# EAGLE design M165D (EAGLE 6.6.0)
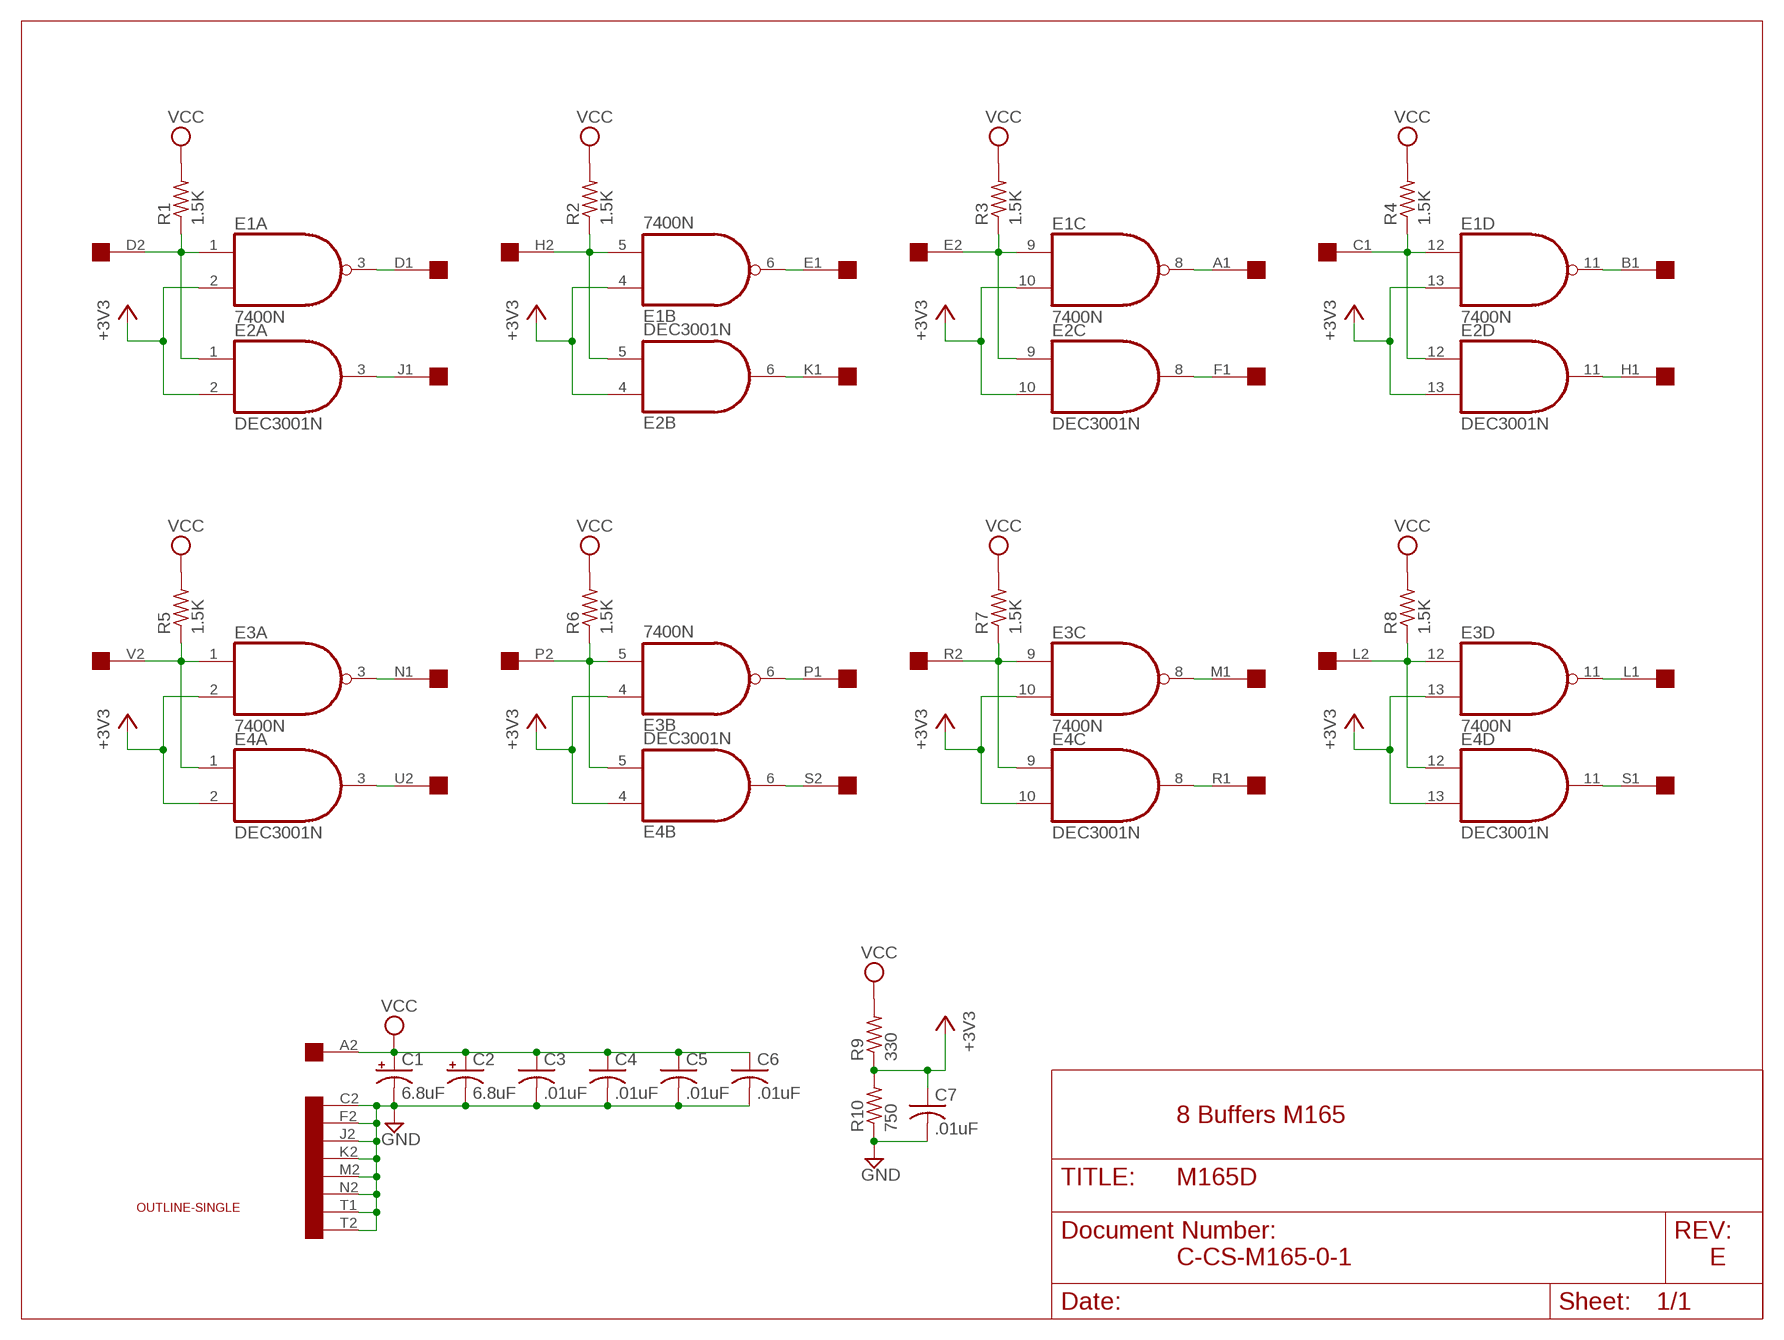
[diagram p0: schematic, sheet 1]

## Parts
C1  6.8uF  CPOL-USE25-9AXIAL  [E25-9]
C2  6.8uF  CPOL-USE25-9AXIAL  [E25-9]
C3  .01uF  C-US050-025X075  [C050-025X075]
C4  .01uF  C-US050-025X075  [C050-025X075]
C5  .01uF  C-US050-025X075  [C050-025X075]
C6  .01uF  C-US050-025X075  [C050-025X075]
C7  .01uF  C-US050-025X075  [C050-025X075]
E1  7400N  [DIL14]
E2  DEC3001N  74S08N  [DIL14]
E3  7400N  [DIL14]
E4  DEC3001N  74S08N  [DIL14]
R1  1.5K  R-US_0207/10  [0207/10]
R2  1.5K  R-US_0207/10  [0207/10]
R3  1.5K  R-US_0207/10  [0207/10]
R4  1.5K  R-US_0207/10  [0207/10]
R5  1.5K  R-US_0207/10  [0207/10]
R6  1.5K  R-US_0207/10  [0207/10]
R7  1.5K  R-US_0207/10  [0207/10]
R8  1.5K  R-US_0207/10  [0207/10]
R9  330  R-US_0207/10  [0207/10]
R10  750  R-US_0207/10  [0207/10]
U$1  SINGLE  [EDGE-CON2]
U$2  OUTLINE-SINGLE  [SINGLE]

## Nets
+3V3 [supply]: C7.1 E1.2(A:I1) E1.4(B:I0) E1.10(C:I1) E1.13(D:I1) E2.2(A:I1) E2.4(B:I0) E2.10(C:I1) E2.13(D:I1) E3.2(A:I1) E3.4(B:I0) E3.10(C:I1) E3.13(D:I1) E4.2(A:I1) E4.4(B:I0) E4.10(C:I1) E4.13(D:I1) R9.1 R10.2
GND [supply]: C1.- C2.- C3.2 C4.2 C5.2 C6.2 C7.2 R10.1 U$1.C2 U$1.F2 U$1.J2 U$1.K2 U$1.M2 U$1.N2 U$1.T1 U$1.T2
N$1: E1.1(A:I0) E2.1(A:I0) R1.1 U$1.D2
N$2: E1.5(B:I1) E2.5(B:I1) R2.1 U$1.H2
N$3: E2.3(A:O) U$1.J1
N$4: E1.3(A:O) U$1.D1
N$5: E2.6(B:O) U$1.K1
N$6: E1.6(B:O) U$1.E1
N$7: E1.9(C:I0) E2.9(C:I0) R3.1 U$1.E2
N$8: E2.8(C:O) U$1.F1
N$9: E1.8(C:O) U$1.A1
N$10: E1.12(D:I0) E2.12(D:I0) R4.1 U$1.C1
N$11: E2.11(D:O) U$1.H1
N$12: E1.11(D:O) U$1.B1
N$13: E3.1(A:I0) E4.1(A:I0) R5.1 U$1.V2
N$14: E4.3(A:O) U$1.U2
N$15: E3.3(A:O) U$1.N1
N$16: E3.5(B:I1) E4.5(B:I1) R6.1 U$1.P2
N$17: E4.6(B:O) U$1.S2
N$18: E3.6(B:O) U$1.P1
N$19: E3.9(C:I0) E4.9(C:I0) R7.1 U$1.R2
N$20: E4.8(C:O) U$1.R1
N$21: E3.8(C:O) U$1.M1
N$22: E3.12(D:I0) E4.12(D:I0) R8.1 U$1.L2
N$23: E4.11(D:O) U$1.S1
N$24: E3.11(D:O) U$1.L1
VCC [supply]: C1.+ C2.+ C3.1 C4.1 C5.1 C6.1 R1.2 R2.2 R3.2 R4.2 R5.2 R6.2 R7.2 R8.2 R9.2 U$1.A2
Unconnected: U$1.B2 U$1.U1 U$1.V1

## Notes on the sheet
- 8 Buffers M165
- C-CS-M165-0-1 | E

## Power pins joined to a net without a drawn wire
GND: E1.7(P:GND) E2.7(P:GND) E3.7(P:GND) E4.7(P:GND)
VCC: E1.14(P:VCC) E2.14(P:VCC) E3.14(P:VCC) E4.14(P:VCC)

## Library data of the parts
C1 C2 = rcl:CPOL-US: POLARIZED CAPACITOR, American symbol
C3-C7 = rcl:C-US: CAPACITOR, American symbol
E1 E3 = 74xx-us:74*00: Quad 2-input NAND gate
E2 E4 = 74xx-us:74*08: Quad 2-input AND gate
R1-R10 = rcl:R-US_: RESISTOR, American symbol
U$1 = dec-con:SINGLE: Single-Height DEC board
U$2 = dec-con:OUTLINE-*: Board outlines for DEC boards.

## Net classes
1 supply: width 0.813 mm

## Board
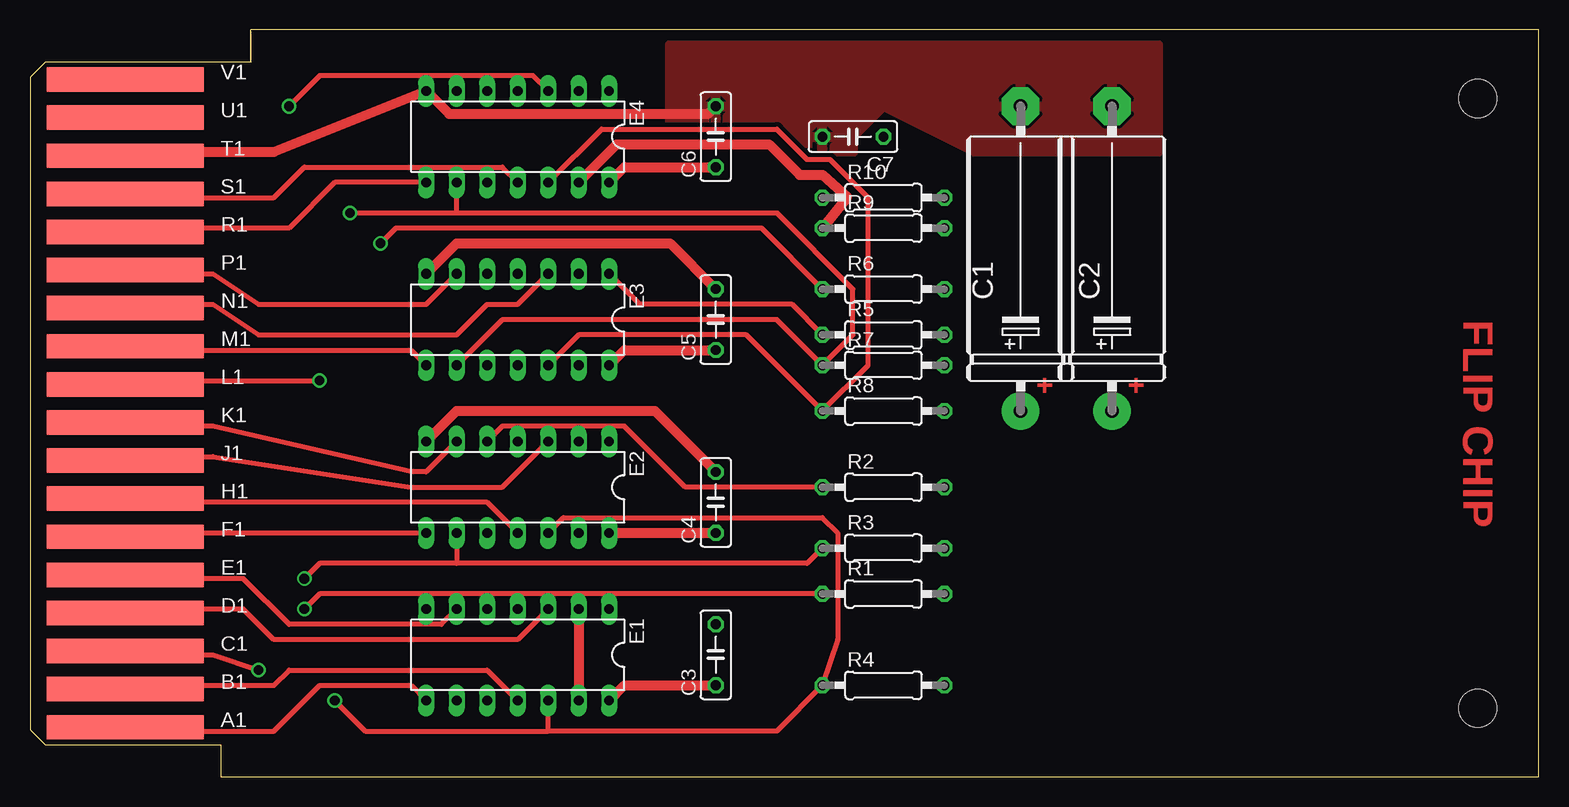
[diagram p1: board, top side]
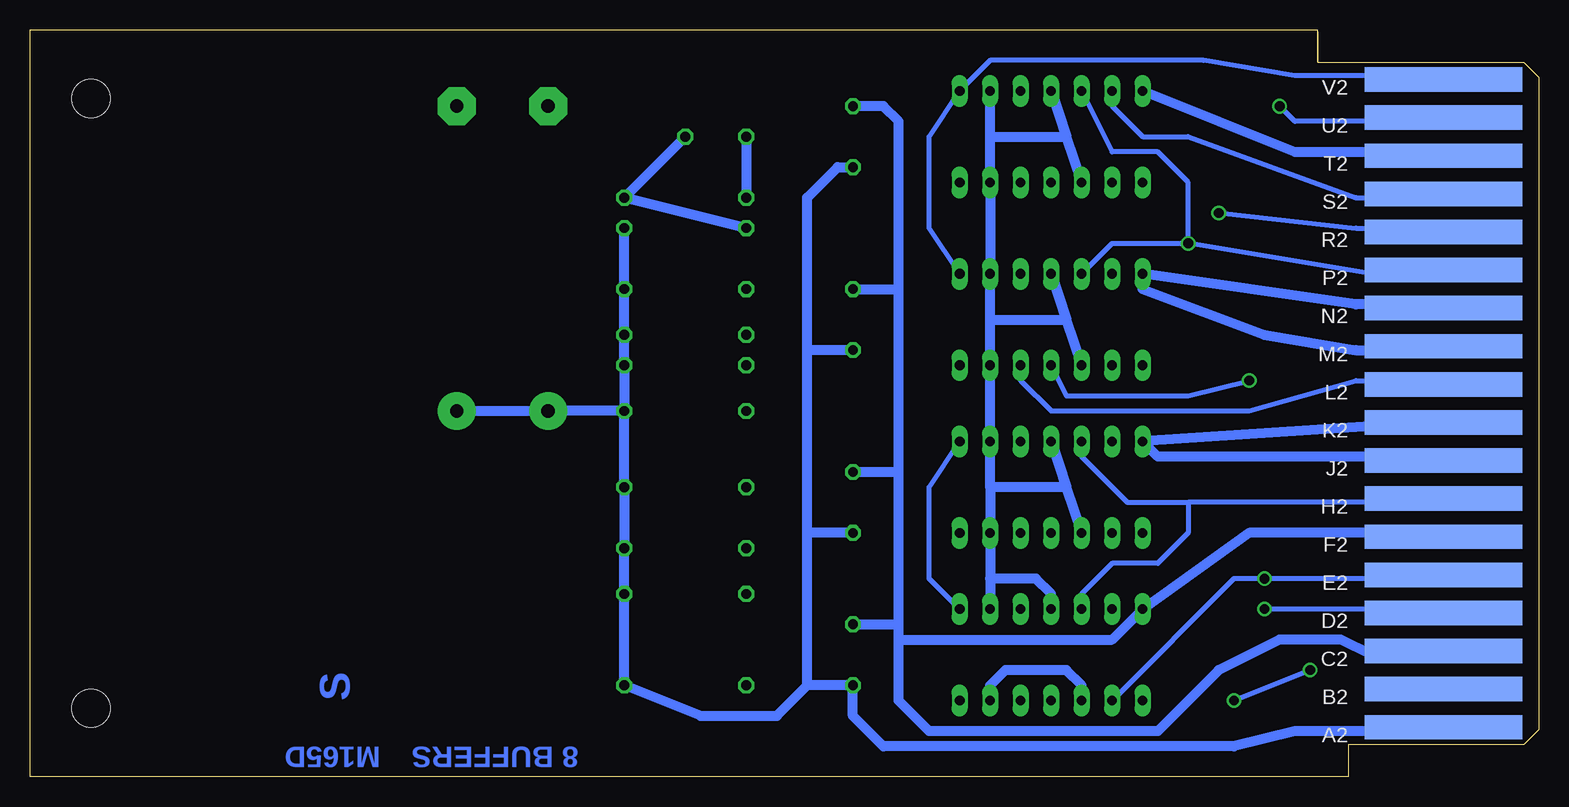
[diagram p2: board, bottom side, seen from below]

Size 125.73 x 62.23 mm. Coordinates in mm from the lower left corner, seen from the top.
Copper layers (1+16): Top 0.035mm / dielectric 1.5mm / Bottom 0.035mm
Design rules "16mils": minimum track width 16mil, minimum drill 32mil, track to track 15mil, track to pad 10mil, pad to pad 10mil, via to via 10mil, smd to smd 10mil, copper to edge 13mil, drill to drill 10mil, minimum pad ring 10mil, minimum via ring 8mil, stop-mask expansion 0mil, vias tented up to drill 0mil, thermal gap 10mil

### Footprints (pad centres in the part's own frame; a part is rotated, then mirrored left to right if it is on the bottom)
E25-9 = drill 1.118 pad 3.15: + -12.7,0 | drill 1.118 pad 3.15 octagon: - 12.7,0
C050-025X075 = drill 0.813 octagon: 1 -2.54,0; 2 2.54,0
DIL14 = drill 0.813 long: 1 -7.62,-3.81; 2 -5.08,-3.81; 3 -2.54,-3.81; 4 0,-3.81; 5 2.54,-3.81; 6 5.08,-3.81; 7 7.62,-3.81; 8 7.62,3.81; 9 5.08,3.81; 10 2.54,3.81; 11 0,3.81; 12 -2.54,3.81; 13 -5.08,3.81; 14 -7.62,3.81
0207/10 = drill 0.813 octagon: 1 -5.08,0; 2 5.08,0
EDGE-CON2 = smd 13.106 x 2.032: A1 7.938,4.128; B1 7.938,7.303; C1 7.938,10.477; D1 7.938,13.652; E1 7.938,16.828; F1 7.938,20.003; H1 7.938,23.177; J1 7.938,26.352; K1 7.938,29.527; L1 7.938,32.703; M1 7.938,35.877; N1 7.938,39.053; P1 7.938,42.227; R1 7.938,45.403; S1 7.938,48.578; T1 7.938,51.752; U1 7.938,54.928; V1 7.938,58.102 | smd 13.106 x 2.032 bottom: A2 7.938,4.128; B2 7.938,7.303; C2 7.938,10.477; D2 7.938,13.652; E2 7.938,16.828; F2 7.938,20.003; H2 7.938,23.177; J2 7.938,26.352; K2 7.938,29.527; L2 7.938,32.703; M2 7.938,35.877; N2 7.938,39.053; P2 7.938,42.227; R2 7.938,45.403; S2 7.938,48.578; T2 7.938,51.752; U2 7.938,54.928; V2 7.938,58.102
SINGLE = hole 3.175: 120.65,56.515; 120.65,5.715

### Placement (x,y rotation side)
C1  82.55,43.18 90 top
C2  90.17,43.18 90 top
C3  57.15,10.16 90 top
C4  57.15,22.86 90 top
C5  57.15,38.1 90 top
C6  57.15,53.34 90 top
C7  68.58,53.34 180 top
E1  40.64,10.16 180 top
E2  40.64,24.13 180 top
E3  40.64,38.1 180 top
E4  40.64,53.34 180 top
R1  71.12,15.24 0 top
R2  71.12,24.13 0 top
R3  71.12,19.05 0 top
R4  71.12,7.62 0 top
R5  71.12,36.83 0 top
R6  71.12,40.64 0 top
R7  71.12,34.29 0 top
R8  71.12,30.48 0 top
R9  71.12,45.72 0 top
R10  71.12,48.26 0 top
U$1  0,0 0 top
U$2  0,0 0 top

### Tracks (layer width: path | path; a pad name or v marks a point on that pad's centre or on a via)
+3V3
  Top 0.813: E1.2 E1.13 | E4.13 48.9,52.7 61.6,52.7 64.14,50.16 66.04,50.16 68.09,48.3 R9.1
  Bottom 0.813: E1.10 38.1,7.62 39.37,8.89 44.45,8.89 45.72,7.62 E1.13 | E1.4 40.64,15.24 41.91,16.51 45.72,16.51 | 45.72,16.51 E1.2 | 45.72,16.51 E2.13 45.72,24.13 | E2.10 39.37,24.13 | 39.37,24.13 45.72,24.13 | E2.4 39.37,24.13 | 45.72,24.13 E2.2 E3.13 45.72,38.1 | 45.72,38.1 39.37,38.1 | 39.37,38.1 E3.10 | E3.4 39.37,38.1 | 45.72,38.1 E3.2 E4.13 45.72,53.34 | 45.72,53.34 39.37,53.34 | 39.37,53.34 E4.10 | E4.4 39.37,53.34 | 45.72,53.34 E4.2 | R9.1 R10.2 C7.1
GND
  Top 0.813: E2.7 35.56,30.48 52.07,30.48 C4.2 | E3.7 35.56,44.45 53.34,44.45 C5.2 | U$1.T1 8.89,52.07 20.32,52.07 E4.7 34.93,55.24 56.52,55.24 C6.2
  Bottom 0.813: U$1.C2 8.89,10.16 13.97,10.16 16.51,11.43 21.59,11.43 26.67,8.89 31.75,3.81 50.8,3.81 53.34,6.35 53.34,11.43 | 53.34,11.43 35.56,11.43 E1.7 24.13,20.32 8.89,20.32 U$1.F2 | 53.34,11.43 53.34,12.7 | 53.34,12.7 53.34,25.4 | 53.34,25.4 53.34,40.64 | 53.34,40.64 53.34,54.61 54.61,55.88 C6.2 | C5.2 53.34,40.64 | C4.2 53.34,25.4 | C3.2 53.34,12.7 | U$1.J2 8.89,26.67 31.75,26.67 E2.7 13.97,29.21 8.26,29.21 U$1.K2 | U$1.M2 8.89,35.56 15.24,35.56 22.86,36.83 33.02,40.64 E3.7 15.24,39.37 8.89,39.37 U$1.N2 | E4.7 20.32,52.07 8.89,52.07 U$1.T1 | C7.2 R10.1
  pour Top: 53.34,53.34 53.34,60.96 93.98,60.96 93.98,52.07 78.74,52.07 71.12,55.88 68.58,53.34 68.58,52.07 63.5,52.07 63.5,53.34
N$1  (via drill 0.81)
  Top 0.406: R1.1 48.26,15.24 | E1.1 48.26,15.24 | 48.26,15.24 24.13,15.24 v22.86,13.97
  Bottom 0.406: E1.1 50.8,16.51 50.8,24.13 E2.1 | U$1.D2 8.89,13.97 v22.86,13.97
N$2
  Top 0.406: R2.1 54.61,24.13 49.53,29.21 39.37,29.21 E2.5
  Bottom 0.406: U$1.H2 8.89,22.86 29.21,22.86 | 29.21,22.86 29.21,20.32 31.75,17.78 35.56,17.78 38.1,15.24 E1.5 | E2.5 38.1,26.67 34.29,22.86 29.21,22.86
N$3
  Top 0.406: U$1.J1 8.89,26.67 15.24,26.67 31.75,24.13 39.37,24.13 E2.3
N$4
  Top 0.406: E1.3 40.64,11.43 20.32,11.43 17.78,13.97 8.89,13.97 U$1.D1
N$5
  Top 0.406: E2.6 33.02,25.4 31.75,25.4 15.24,29.21 8.89,29.21 U$1.K1
N$6
  Top 0.406: E1.6 34.29,12.7 21.59,12.7 17.78,16.51 8.89,16.51 U$1.E1
N$7  (via drill 0.81)
  Top 0.406: E2.9 35.56,17.78 | R3.1 64.77,17.78 35.56,17.78 | 35.56,17.78 24.13,17.78 v22.86,16.51
  Bottom 0.406: U$1.E2 10.16,16.51 v22.86,16.51 25.4,16.51 E1.9
N$8
  Top 0.406: U$1.F1 8.89,20.32 E2.8
N$9
  Top 0.406: U$1.A1 8.89,3.81 20.32,3.81 24.13,7.62 31.75,7.62 E1.8
N$10  (via drill 0.81)
  Top 0.406: U$1.C1 8.89,10.16 15.24,10.16 v19.05,8.89 | v25.4,6.35 27.94,3.81 43.18,3.81 | 43.18,3.81 E1.12 | 43.18,3.81 62.23,3.81 R4.1 67.31,11.43 67.31,20.32 66.04,21.59 44.45,21.59 E2.12
  Bottom 0.406: v19.05,8.89 v25.4,6.35
N$11
  Top 0.406: E2.11 38.1,22.86 8.89,22.86 U$1.H1
N$12
  Top 0.406: U$1.B1 8.89,7.62 20.32,7.62 21.59,8.89 38.1,8.89 E1.11
N$13
  Top 0.406: R5.1 63.5,39.37 50.8,39.37 E3.1
  Bottom 0.406: E3.1 50.8,45.72 50.8,53.34 E4.1 45.72,59.69 27.94,59.69 20.32,58.42 8.89,58.42 U$1.V2
N$14  (via drill 0.81)
  Top 0.406: E4.3 41.91,58.42 24.13,58.42 v21.59,55.88
  Bottom 0.406: U$1.U2 8.89,54.61 20.32,54.61 v21.59,55.88
N$15
  Top 0.406: U$1.N1 8.89,39.37 15.24,39.37 19.05,36.83 35.56,36.83 38.1,39.37 40.64,39.37 E3.3
N$16  (via drill 0.81)
  Top 0.406: R6.1 60.96,45.72 30.48,45.72 v29.21,44.45
  Bottom 0.406: E3.5 35.56,44.45 v29.21,44.45 | v29.21,44.45 29.21,49.53 31.75,52.07 35.56,52.07 E4.5 | U$1.P2 8.89,41.91 13.97,41.91 v29.21,44.45
N$17
  Bottom 0.406: E4.6 35.56,55.88 33.02,53.34 29.21,53.34 15.24,48.26 8.89,48.26 U$1.S2
N$18
  Top 0.406: U$1.P1 8.89,41.91 15.24,41.91 19.05,39.37 33.02,39.37 E3.6
N$19  (via drill 0.81)
  Top 0.406: v26.67,46.99 35.56,46.99 | 35.56,46.99 E4.9 | 35.56,46.99 62.23,46.99 68.58,40.64 68.58,36.83 R7.1 62.23,38.1 39.37,38.1 E3.9
  Bottom 0.406: v26.67,46.99 15.24,45.72 8.89,45.72 U$1.R2
N$20
  Top 0.406: E4.8 25.4,49.53 21.59,45.72 8.89,45.72 U$1.R1
N$21
  Top 0.406: U$1.M1 8.89,35.56 31.75,35.56 E3.8
N$22
  Top 0.406: E4.12 47.63,53.98 62.23,53.98 64.77,51.44 66.68,51.44 69.85,48.26 69.85,34.29 R8.1 59.69,36.83 45.72,36.83 E3.12
  Bottom 0.406: E3.12 43.18,33.02 40.64,30.48 24.13,30.48 15.24,33.02 8.89,33.02 U$1.L2
N$23
  Top 0.406: U$1.S1 8.89,48.26 20.32,48.26 22.86,50.8 39.37,50.8 E4.11
N$24  (via drill 0.81)
  Top 0.406: U$1.L1 8.89,33.02 v24.13,33.02
  Bottom 0.406: E3.11 39.37,31.75 29.21,31.75 v24.13,33.02
VCC
  Top 0.813: E1.14 49.53,7.62 C3.1 | E2.14 C4.1 | E3.14 49.53,35.56 C5.1 | E4.14 49.53,50.8 C6.1
  Bottom 0.813: U$1.A2 8.26,3.81 20.32,3.81 25.4,2.54 54.61,2.54 57.15,5.08 C3.1 60.96,7.62 | 60.96,7.62 60.96,20.32 | 60.96,20.32 60.96,35.56 | 60.96,35.56 60.96,48.26 58.42,50.8 C6.1 | C5.1 60.96,35.56 | C4.1 60.96,20.32 | 60.96,7.62 63.5,5.08 69.85,5.08 R4.2 R1.2 R3.2 R2.2 R8.2 | C2.+ C1.+ R8.2 | R8.2 R7.2 R5.2 R6.2 R9.2

### Text on the board
Top: FLIP CHIP | + | +
Bottom: S | 8 BUFFERS | M165D